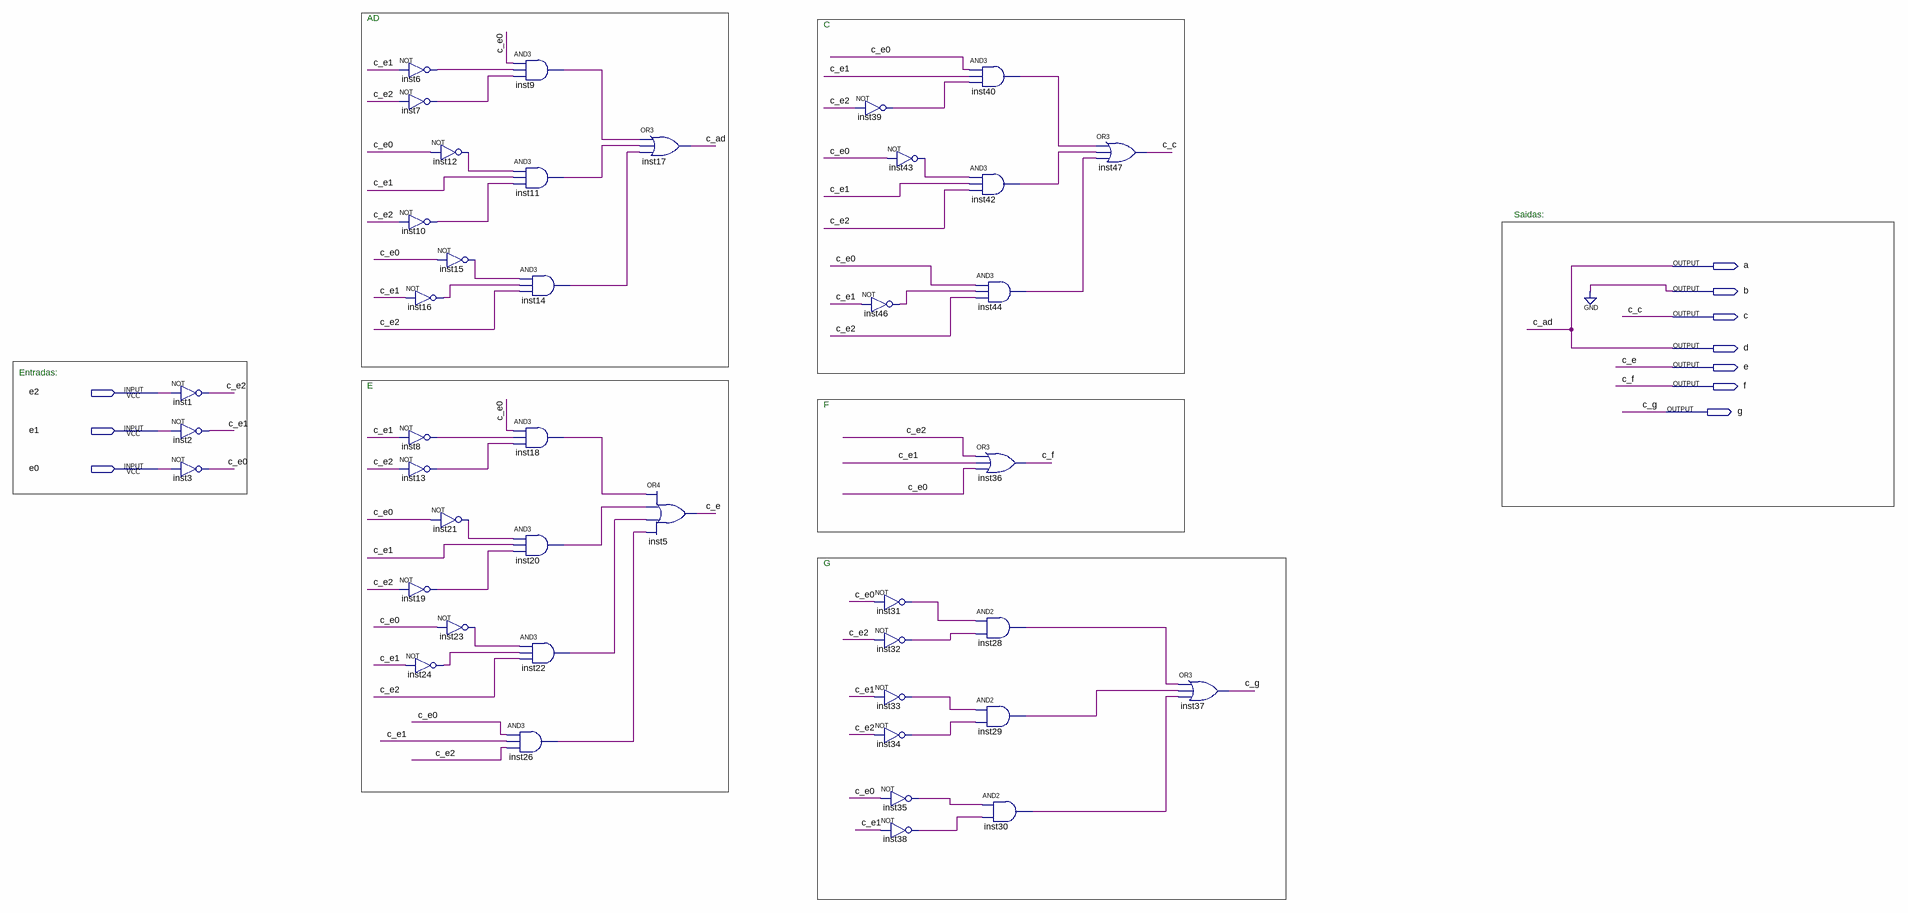
[diagram p0: schematic sheet]
// Quartus schematic numero_apertados.bdf as structural Verilog: 42 symbols, 10 pins
module numero_apertados (
  input  e2,
  input  e1,
  input  e0,
  output a,
  output b,
  output c,
  output d,
  output e,
  output f,
  output g
);

  wire c_e0, c_e1, c_e2, inst6_out, inst7_out, inst8_out, inst9_out, inst10_out, inst11_out, inst12_out,
       inst13_out, inst14_out, inst15_out, inst16_out, inst18_out, inst19_out, inst20_out, inst21_out,
       inst22_out, inst23_out, inst24_out, inst26_out, inst28_out, inst29_out, inst30_out, inst31_out,
       inst32_out, inst33_out, inst34_out, inst35_out, inst38_out, inst39_out, inst40_out, inst42_out,
       inst43_out, inst44_out, inst46_out;

  not inst1 (c_e2, e2);
  not inst2 (c_e1, e1);
  not inst3 (c_e0, e0);
  not inst6 (inst6_out, c_e1);
  not inst7 (inst7_out, c_e2);
  not inst12 (inst12_out, c_e0);
  not inst10 (inst10_out, c_e2);
  not inst15 (inst15_out, c_e0);
  not inst16 (inst16_out, c_e1);
  not inst8 (inst8_out, c_e1);
  not inst13 (inst13_out, c_e2);
  not inst21 (inst21_out, c_e0);
  not inst19 (inst19_out, c_e2);
  not inst23 (inst23_out, c_e0);
  not inst24 (inst24_out, c_e1);
  and inst9 (inst9_out, c_e0, inst6_out, inst7_out);
  and inst11 (inst11_out, inst12_out, c_e1, inst10_out);
  and inst14 (inst14_out, inst15_out, inst16_out, c_e2);
  and inst18 (inst18_out, c_e0, inst8_out, inst13_out);
  and inst20 (inst20_out, inst21_out, c_e1, inst19_out);
  and inst22 (inst22_out, inst23_out, inst24_out, c_e2);
  and inst26 (inst26_out, c_e0, c_e1, c_e2);
  or inst17 (a, inst9_out, inst11_out, inst14_out);
  or inst5 (e, inst18_out, inst20_out, inst22_out, inst26_out);
  not inst39 (inst39_out, c_e2);
  not inst43 (inst43_out, c_e0);
  not inst46 (inst46_out, c_e1);
  not inst31 (inst31_out, c_e0);
  not inst32 (inst32_out, c_e2);
  not inst33 (inst33_out, c_e1);
  not inst34 (inst34_out, c_e2);
  not inst35 (inst35_out, c_e0);
  not inst38 (inst38_out, c_e1);
  and inst40 (inst40_out, c_e0, c_e1, inst39_out);
  and inst42 (inst42_out, inst43_out, c_e1, c_e2);
  and inst44 (inst44_out, c_e0, inst46_out, c_e2);
  or inst36 (f, c_e2, c_e1, c_e0);
  and inst28 (inst28_out, inst31_out, inst32_out);
  and inst29 (inst29_out, inst33_out, inst34_out);
  and inst30 (inst30_out, inst35_out, inst38_out);
  or inst47 (c, inst40_out, inst42_out, inst44_out);
  or inst37 (g, inst28_out, inst29_out, inst30_out);

  assign b = 1'b0;
  assign d = a;

  // Other names for the same wires on the sheet: c_ad = a; c_c = c; c_e = e; c_f = f; c_g = g

  // Notes on the sheet:
  //   AD
  //   C
  //   Saidas:
  //   Entradas:
  //   E
  //   F
  //   G
endmodule
